# Altium schematic sheet BANK14-15.SchDoc
size A4
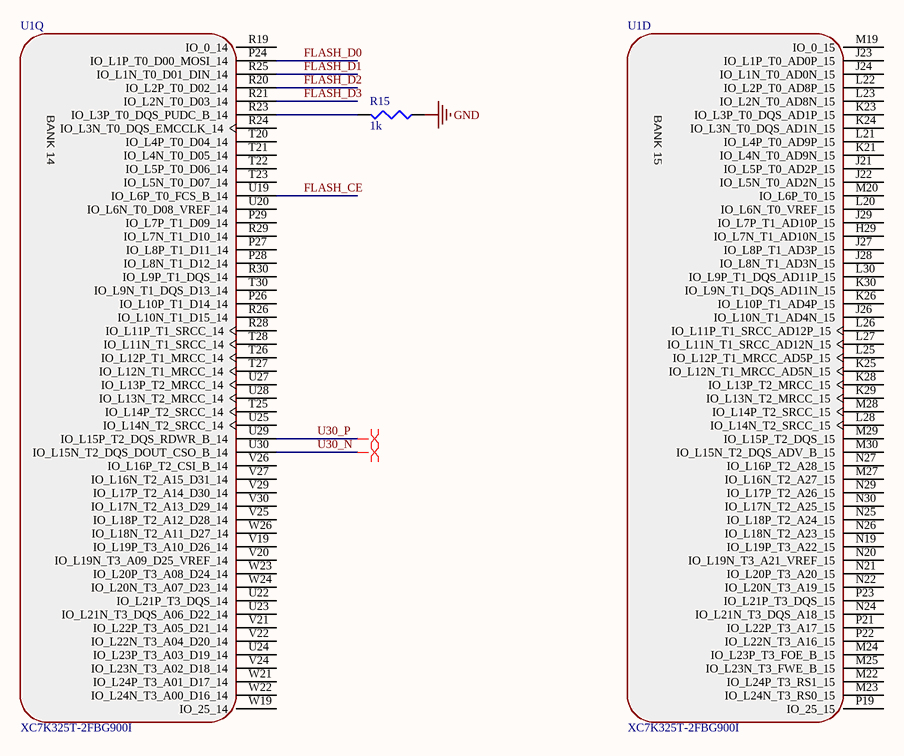
[diagram p0: BANK14-15.SchDoc]

## Parts
R15  value 1k  [J1-0603]  (hidden comment: Res3)
U1  XC7K325T-2FBG900I  [FBG900]  (parts D,Q of 17)

## Nets
GND: R15.1
FLASH_CE: U1.U19(IO_L6P_T0_FCS_B_14)
FLASH_D0: U1.P24(IO_L1P_T0_D00_MOSI_14)
FLASH_D1: U1.R25(IO_L1N_T0_D01_DIN_14)
FLASH_D2: U1.R20(IO_L2P_T0_D02_14)
FLASH_D3: U1.R21(IO_L2N_T0_D03_14)
U30_N: U1.U30(IO_L15N_T2_DQS_DOUT_CSO_B_14)
U30_P: U1.U29(IO_L15P_T2_DQS_RDWR_B_14)
NetR15_2: R15.2 U1.R23(IO_L3P_T0_DQS_PUDC_B_14)

Not connected (* = marked no-connect by the designer): U1 H29(IO_L7N_T1_AD10N_15) J21(IO_L5P_T0_AD2P_15) J22(IO_L5N_T0_AD2N_15) J23(IO_L1P_T0_AD0P_15) J24(IO_L1N_T0_AD0N_15) J26(IO_L10N_T1_AD4N_15) J27(IO_L8P_T1_AD3P_15) J28(IO_L8N_T1_AD3N_15) J29(IO_L7P_T1_AD10P_15) K21(IO_L4N_T0_AD9N_15) K23(IO_L3P_T0_DQS_AD1P_15) K24(IO_L3N_T0_DQS_AD1N_15) K25(IO_L12N_T1_MRCC_AD5N_15) K26(IO_L10P_T1_AD4P_15) K28(IO_L13P_T2_MRCC_15) K29(IO_L13N_T2_MRCC_15) K30(IO_L9N_T1_DQS_AD11N_15) L20(IO_L6N_T0_VREF_15) L21(IO_L4P_T0_AD9P_15) L22(IO_L2P_T0_AD8P_15) L23(IO_L2N_T0_AD8N_15) L25(IO_L12P_T1_MRCC_AD5P_15) L26(IO_L11P_T1_SRCC_AD12P_15) L27(IO_L11N_T1_SRCC_AD12N_15) L28(IO_L14N_T2_SRCC_15) L30(IO_L9P_T1_DQS_AD11P_15) M19(IO_0_15) M20(IO_L6P_T0_15) M22(IO_L24P_T3_RS1_15) M23(IO_L24N_T3_RS0_15) M24(IO_L23P_T3_FOE_B_15) M25(IO_L23N_T3_FWE_B_15) M27(IO_L16N_T2_A27_15) M28(IO_L14P_T2_SRCC_15) M29(IO_L15P_T2_DQS_15) M30(IO_L15N_T2_DQS_ADV_B_15) N19(IO_L19P_T3_A22_15) N20(IO_L19N_T3_A21_VREF_15) N21(IO_L20P_T3_A20_15) N22(IO_L20N_T3_A19_15) N24(IO_L21N_T3_DQS_A18_15) N25(IO_L18P_T2_A24_15) N26(IO_L18N_T2_A23_15) N27(IO_L16P_T2_A28_15) N29(IO_L17P_T2_A26_15) N30(IO_L17N_T2_A25_15) P19(IO_25_15) P21(IO_L22P_T3_A17_15) P22(IO_L22N_T3_A16_15) P23(IO_L21P_T3_DQS_15) P26(IO_L10P_T1_D14_14) P27(IO_L8P_T1_D11_14) P28(IO_L8N_T1_D12_14) P29(IO_L7P_T1_D09_14) R19(IO_0_14) R24(IO_L3N_T0_DQS_EMCCLK_14) R26(IO_L10N_T1_D15_14) R28(IO_L11P_T1_SRCC_14) R29(IO_L7N_T1_D10_14) R30(IO_L9P_T1_DQS_14) T20(IO_L4P_T0_D04_14) T21(IO_L4N_T0_D05_14) T22(IO_L5P_T0_D06_14) T23(IO_L5N_T0_D07_14) T25(IO_L14P_T2_SRCC_14) T26(IO_L12P_T1_MRCC_14) T27(IO_L12N_T1_MRCC_14) T28(IO_L11N_T1_SRCC_14) T30(IO_L9N_T1_DQS_D13_14) U20(IO_L6N_T0_D08_VREF_14) U22(IO_L21P_T3_DQS_14) U23(IO_L21N_T3_DQS_A06_D22_14) U24(IO_L23P_T3_A03_D19_14) U25(IO_L14N_T2_SRCC_14) U27(IO_L13P_T2_MRCC_14) U28(IO_L13N_T2_MRCC_14) V19(IO_L19P_T3_A10_D26_14) V20(IO_L19N_T3_A09_D25_VREF_14) V21(IO_L22P_T3_A05_D21_14) V22(IO_L22N_T3_A04_D20_14) V24(IO_L23N_T3_A02_D18_14) V25(IO_L18P_T2_A12_D28_14) V26(IO_L16P_T2_CSI_B_14) V27(IO_L16N_T2_A15_D31_14) V29(IO_L17P_T2_A14_D30_14) V30(IO_L17N_T2_A13_D29_14) W19(IO_25_14) W21(IO_L24P_T3_A01_D17_14) W22(IO_L24N_T3_A00_D16_14) W23(IO_L20P_T3_A08_D24_14) W24(IO_L20N_T3_A07_D23_14) W26(IO_L18N_T2_A11_D27_14)

## Layout directives
differential pair: U30_N, U30_P

## Notes on the sheet
- (in symbol XC7K325T-2FBG900I, part D) BANK 15
- (in symbol XC7K325T-2FBG900I, part Q) BANK 14

## Library data of the parts
R15 = Res3: Resistor; Published: 8-Jun-2000; LatestRevisionDate: 29-May-2009; LatestRevisionNote: IPC-7351 Footprint Added.; PackageReference: J1-0603; Publisher: Altium Limited; PackageDescription: Chip Resistor